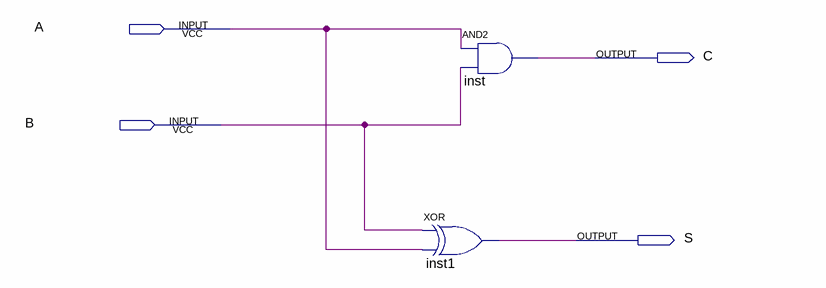
[diagram p0: schematic sheet]
// Quartus schematic HA.bdf as structural Verilog: 2 symbols, 4 pins
module HA (
  input  A,
  input  B,
  output C,
  output S
);

  xor inst1 (S, B, A);
  and inst (C, A, B);
endmodule
